# Altium schematic sheet Atmospheric.SchDoc: Atmospheric Sensors
size A4; DrawnBy: Samyar Sadat Akhavi; Revision: 1.0; SheetNumber: 3; SheetTotal: 3
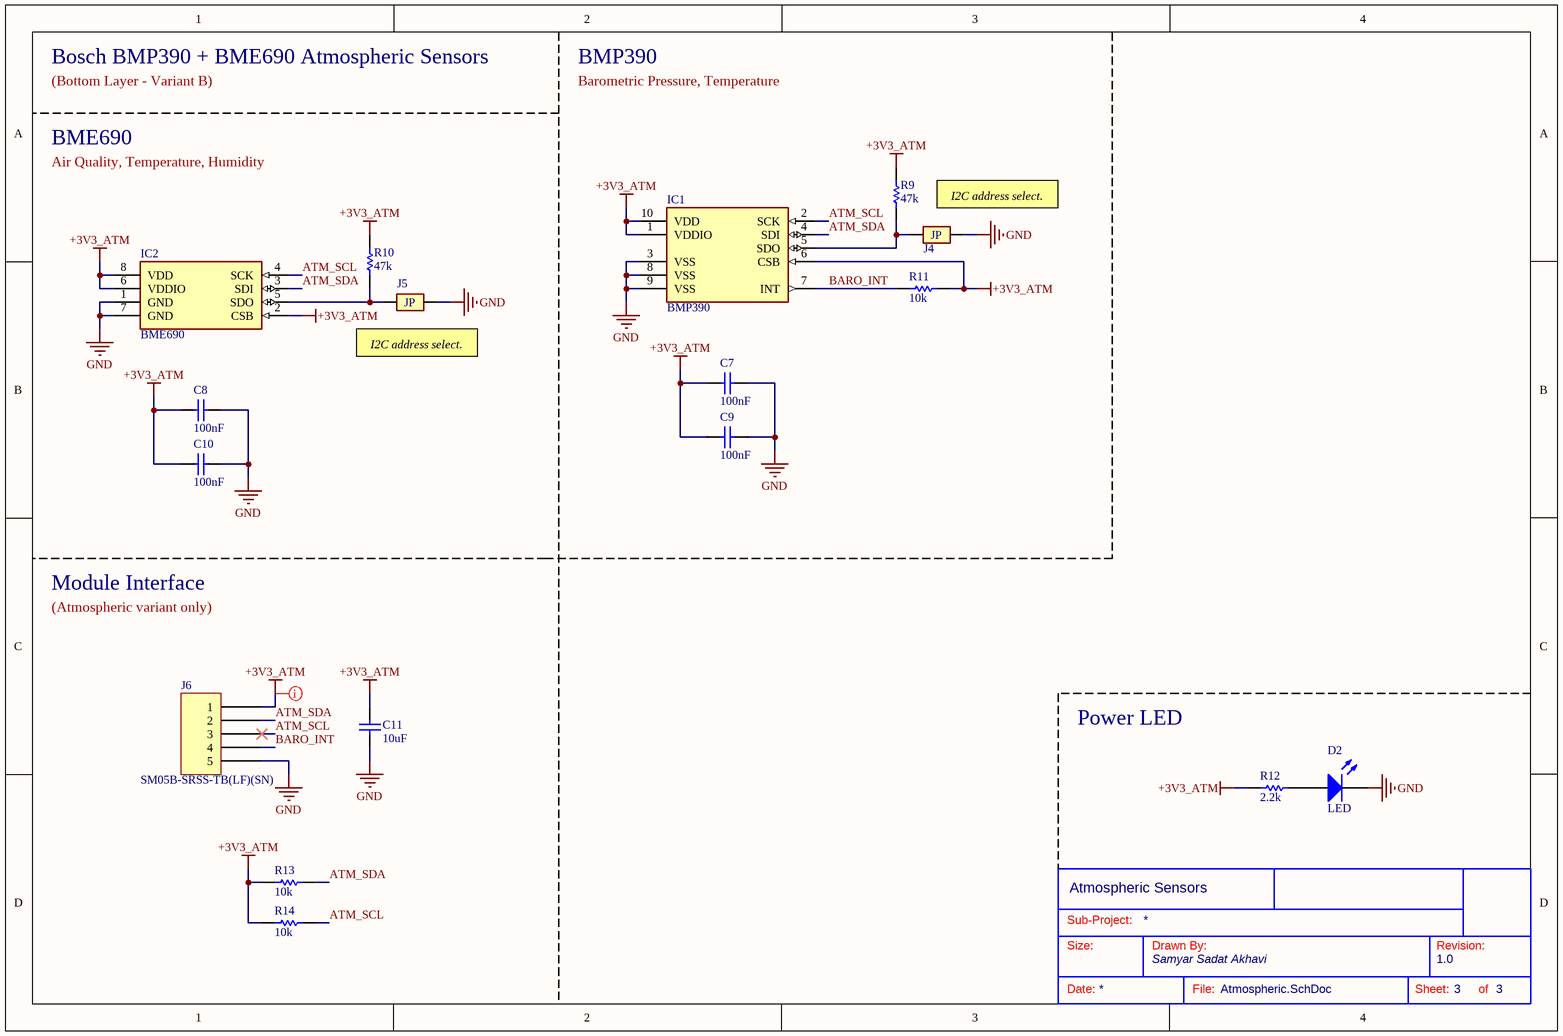
[diagram p0: Atmospheric.SchDoc]

## Parts
?  (no value)  (graphical)
C7  100nF  [CAP_SMD_603]
C8  100nF  [CAP_SMD_603]
C9  100nF  [CAP_SMD_603]
C10  100nF  [CAP_SMD_603]
C11  10uF  [CAP_SMD_603]
D2  LED  [LED 0805_2012 RED]
IC1  BMP390  [BMP390]
IC2  BME690  [BME690]
J4  Jumper Pad  [Jumper Pad]  (value not drawn)  (no BOM)
J5  Jumper Pad  [Jumper Pad]  (value not drawn)  (no BOM)
J6  SM05B-SRSS-TB(LF)(SN)  [JST SM05B-SRSS-TB]
R9  47k  [RES_0603]
R10  47k  [RES_0603]
R11  10k  [RES_0603]
R12  2.2k  [RES_0603]
R13  10k  [RES_0603]
R14  10k  [RES_0603]

## Nets
+3V3_ATM: C7.2 C8.2 C9.1 C10.1 C11.2 IC1.1(VDDIO) IC1.6(CSB) IC1.10(VDD) IC2.2(CSB) IC2.6(VDDIO) IC2.8(VDD) J6.1 R9.2 R10.2 R11.1 R12.1 R13.1 R14.1
GND: C7.1 C8.1 C9.2 C10.2 C11.1 D2.2(K) IC1.3(VSS) IC1.8(VSS) IC1.9(VSS) IC2.1(GND) IC2.7(GND) J4.2 J5.2 J6.5
ATM_SCL: IC1.2(SCK) IC2.4(SCK) J6.3 R14.2
ATM_SDA: IC1.4(SDI) IC2.3(SDI) J6.2 R13.2
BARO_INT: IC1.7(INT) J6.4 R11.2
NetD2_1: D2.1(A) R12.2
NetIC1_5: IC1.5(SDO) J4.1 R9.1
NetIC2_5: IC2.5(SDO) J5.1 R10.1

## Layout directives
rule Supply Nets [Voltage = 3.300]: +3V3_ATM

## Notes on the sheet
- Bosch BMP390 + BME690 Atmospheric Sensors
- (Bottom Layer - Variant B)
- BMP390
- Barometric Pressure, Temperature
- BME690
- Air Quality, Temperature, Humidity
- I2C address select.
- (near J5) I2C address select.
- Module Interface
- (Atmospheric variant only)
- Power LED
- Sub-Project:
- Size:
- Drawn By:
- Revision:
- Date:
- File:
- Sheet:
- of
- (in symbol Jumper Pad) JP

## Library data of the parts
? = Standard Title Block
C7-C11 = Non-polar Capacitor: Generic Ceramic Capacitor; Voltage: 6.3V
  C7-C10: Value: 100nF
  C11: Value: 10uF
D2 = LED: Indicator LED; Color: Red
IC1 = BMP390: Integrated Circuit; Manufacturer_Name: BOSCH; Datasheet Link: https://www.bosch-sensortec.com/media/boschsensortec/downloads/datasheets/bst-bmp390-ds002.pdf; Height: 0.8mm; Manufacturer_Part_Number: BMP390; Mouser Part Number: 262-BMP390; Mouser Price/Stock: https://www.mouser.co.uk/ProductDetail/Bosch-Sensortec/BMP390?qs=QNEnbhJQKvYQVfvRMgo2YA%3D%3D; Arrow Part Number: BMP390; Arrow Price/Stock: https://www.arrow.com/en/products/bmp390/bosch-sensortec?utm_currency=USD&region=nac
IC2 = BME690: Integrated Circuit; Manufacturer_Name: BOSCH; Datasheet Link: https://www.bosch-sensortec.com/products/environmental-sensors/gas-sensors/bme690/#documents; Height: 1mm; Manufacturer_Part_Number: BME690; Mouser Part Number: 262-BME690; Mouser Price/Stock: https://www.mouser.co.uk/ProductDetail/Bosch-Sensortec/BME690?qs=%252BXxaIXUDbq38jwlEAGDF7A%3D%3D; Arrow Part Number: BME690; Arrow Price/Stock: https://www.arrow.com/en/products/bme690/bosch-sensortec?utm_currency=USD&region=nac
J6 = SM05B-SRSS-TB(LF)(SN): CONN HEADER SMD R/A 5POS 1MM; Manufacturer: JST Sales America Inc.; Current Rating (Amps): 0.7A; Material Flammability Rating: UL94 V-0; Number of Positions: 5; Number of Positions Loaded: All; Pitch - Mating: 0.039" (1.00mm); Shrouding: Shrouded - 4 Wall; Style: Board to Cable/Wire; Voltage Rating: 50V; Part Number: SM05B-SRSS-TB(LF)(SN); ComponentLink1Description: Datasheet; ComponentLink1URL: http://www.jst-mfg.com/product/pdf/eng/eSH.pdf; ComponentLink2Description: DigiKey Link; ComponentLink2URL: http://digikey.com/product-detail/en/jst-sales-america-inc/SM05B-SRSS-TB-LF-SN/455-1805-1-ND/926876; Connector Type: Header; Contact Finish - Mating: Tin; Contact Finish - Post: Tin; Contact Material: Copper Alloy; Contact Shape: Square; Contact Type: Male Pin; Fastening Type: Push-Pull; Features: Solder Retention; Insulation Color: Natural; Insulation Height: 0.114" (2.90mm); Insulation Material: Polyamide (PA), Nylon; LastUpdated: 1/12/2020 11:42:04 PM; Lifecycle Status: Active; Minimum Order: 1; Mounting Type: Surface Mount, Right Angle; Number of Rows: 1; Operating Temperature: -25°C ~ 85°C; Packaging: TapeAndReel; PartId: 63; Part Status: Active; Price: 0.32; Series: SR; Supplier 1: DigiKey; Supplier Part Number 1: 455-1805-1-ND; Termination: Solder
R9-R14 = Resistor: Generic Resistor; Power: 1/8W
  R9 R10: Value: 47k
  R11 R13 R14: Value: 10k
  R12: Value: 2.2k